# Altium project 475_PCB_Collar.PrjPcb
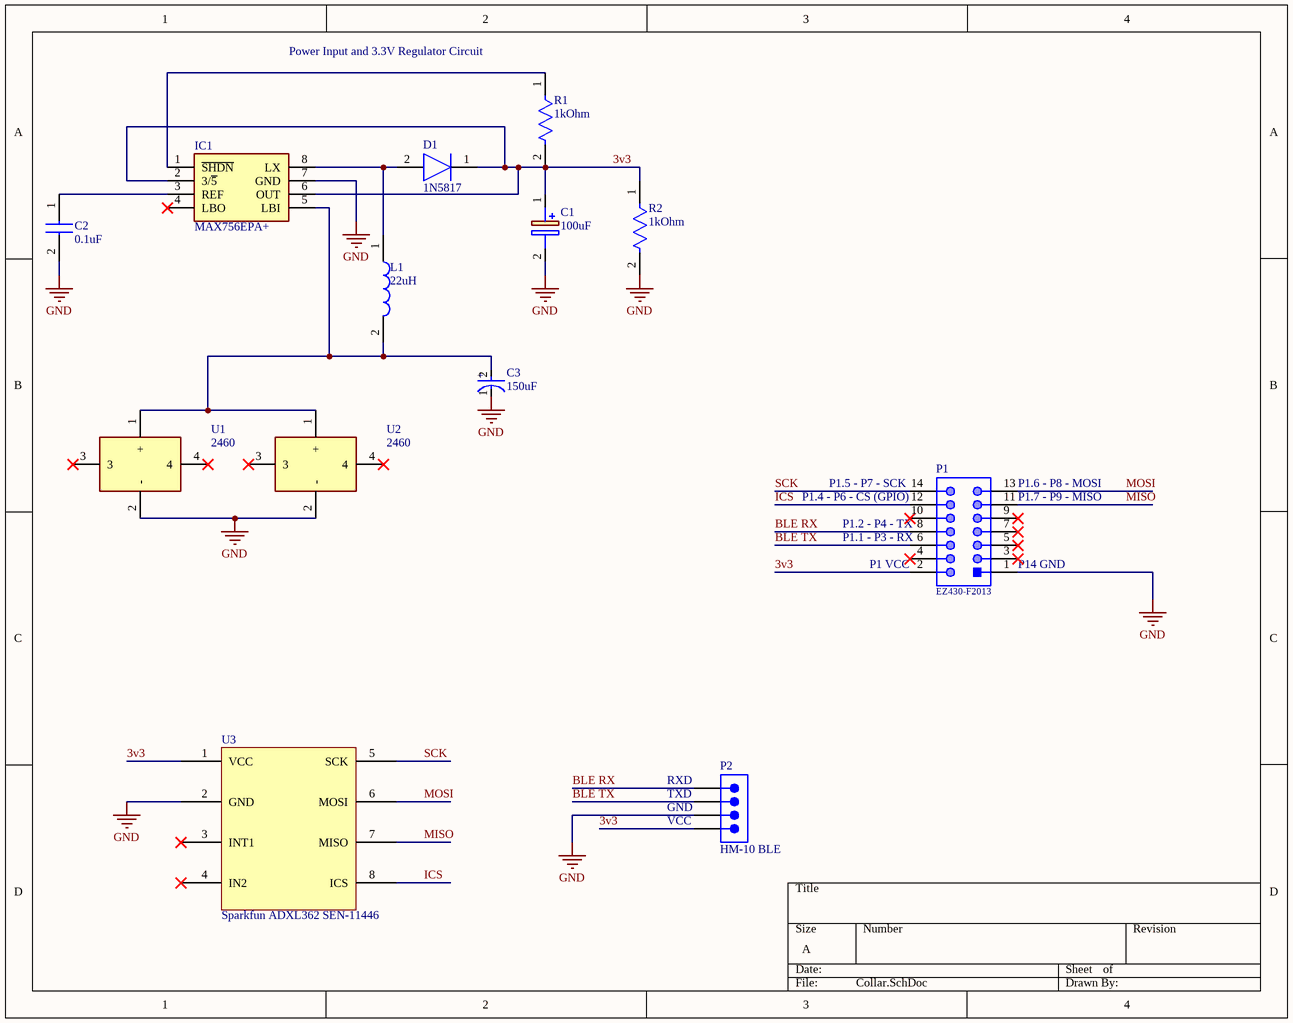
[diagram p0: Collar.SchDoc]
1 sheet, 13 parts. Net scope: global (net labels, ports and power ports of the same name join across sheets).
Board file: Collar.PcbDoc

## Sheet Collar.SchDoc
size A; SheetNumber: 1; SheetTotal: 1

### Parts
C1  100uF  [CAPPRD200W50D550H1250]
C2  0.1uF  [K104K10X7RF5UH5]
C3  150uF  [FP-UCY2V151MHD-MFG]
D1  1N5817  [DIOAD1405W86L465D235]
IC1  MAX756EPA+  [DIP794W56P254L938H457Q8N]
L1  22uH  [INDAD2550W80L950D400]
P1  EZ430-F2013  [61301421121]
P2  HM-10 BLE  [SMTC-TSW-104-08-X-S]
R1  1kOhm  [FP-MRS25-MFG]
R2  1kOhm  [FP-MRS25-MFG]
U1  2460  [2460]
U2  2460  [2460]
U3  Sparkfun ADXL362 SEN-11446  [ADXL362 Breakout Board]

### Nets
GND: C1.2(-) C2.2 C3.1(C) IC1.7(GND) P1.1(P14) P2.2(GND) R2.2 U1.2(-) U2.2(-) U3.2(GND)
3v3: C1.1(+) D1.1(K) IC1.2(3/~{5}) IC1.6(OUT) P1.2(P1) P2.1(VCC) R1.2 R2.1 U3.1(VCC)
BLE RX: P1.8(P4) P2.4(RXD)
BLE TX: P1.6(P3) P2.3(TXD)
ICS: P1.12(P6) U3.8(ICS)
MISO: P1.11(P9) U3.7(MISO)
MOSI: P1.13(P8) U3.6(MOSI)
SCK: P1.14(P7) U3.5(SCK)
NetC2_1: C2.1 IC1.3(REF)
NetC3_2: C3.2(A) IC1.5(LBI) L1.2 U1.1(+) U2.1(+)
NetD1_2: D1.2(A) IC1.8(LX) L1.1
NetIC1_1: IC1.1(~{SHDN}) R1.1

Not connected (* = marked no-connect by the designer): IC1 4(LBO)*; P1 3(P13)* 4(P2)* 5(P12)* 7(P11)* 9(P10)* 10(P5)*; U1 3* 4*; U2 3* 4*; U3 3(INT1)* 4(IN2)*

### Notes on the sheet
- (near R1) Power Input and 3.3V Regulator Circuit
- (near P1) P1.4 - P6 - CS (GPIO)
- (near P1) P1.5 - P7 - SCK
- (near P1) P1.6 - P8 - MOSI
- (near P1) P1.7 - P9 - MISO
- (near P1) P1.2 - P4 - TX
- (near P1) P1.1 - P3 - RX
- (near P1) P1 VCC
- (near P1) P14 GND
- (near P2) RXD
- (near P2) TXD
- (near P2) GND
- (near P2) VCC
- (in symbol CMP-12462-000029-1) +

### Library data of the parts
C1 = 107CKE025MEM: Capacitor Polarised; Manufacturer_Name: Cinch Connectivity Solutions; Datasheet Link: https://componentsearchengine.com/Datasheets/2/107CKE025MEM.pdf; Height: 12.5mm; Manufacturer_Part_Number: 107CKE025MEM
C2 = K104K10X7RF5UH5: Capacitor; Manufacturer_Name: Vishay; Datasheet Link: https://www.vishay.com/docs/45171/kseries.pdf; Height: 6.2mm; Manufacturer_Part_Number: K104K10X7RF5UH5; Mouser Part Number: 594-K104K10X7RF5UH5; Mouser Price/Stock: https://www.mouser.co.uk/ProductDetail/Vishay-BC-Components/K104K10X7RF5UH5?qs=rLgk8CAOBHbAqIwDswVbzA%3D%3D; Arrow Part Number: K104K10X7RF5UH5; Arrow Price/Stock: https://www.arrow.com/en/products/k104k10x7rf5uh5/vishay
C3 = CMP-12462-000029-1: CAP ALUM 150UF 20% 350V RADIAL; Lead/Base Style: Straight; Ripple Current: 1.08A; Life (Hours): 12000Hour; Dissipation Factor: 0.24%; Height - Seated (Max): 1.457inch; Packaging: Bulk; Height: 35.5mm; Voltage Rating (DC): 350V; Min Operating Temperature: -40°C; Max Operating Temperature: 105°C; Case/Package: Radial; Series: CY; Length: 35.5mm; Lead Pitch: 0.295inch; Package Quantity: 50; Tolerance: 20%; Diameter: 18mm; Capacitance: 150uF; Voltage Rating: 350V; RoHS Compliant: Yes; Mount: Through Hole; Features: General Purpose; Termination: Radial
D1 = 1N5817: Diode; Manufacturer_Name: ON Semiconductor; Datasheet Link: http://www.onsemi.com/pub/Collateral/1N5817-D.PDF; Manufacturer_Part_Number: 1N5817; Mouser Part Number: 512-1N5817; Mouser Price/Stock: https://www.mouser.co.uk/ProductDetail/ON-Semiconductor-Fairchild/1N5817?qs=Ro3gc6G1sTm8wr1Du93jFw%3D%3D; Arrow Part Number: 1N5817; Arrow Price/Stock: https://www.arrow.com/en/products/1n5817/on-semiconductor
IC1 = MAX756EPA+: Integrated Circuit; Manufacturer_Name: Maxim Integrated; Datasheet Link: https://datasheets.maximintegrated.com/en/ds/MAX756-MAX757.pdf; Height: 4.572mm; Manufacturer_Part_Number: MAX756EPA+; Mouser Part Number: 700-MAX756EPA; Mouser Price/Stock: https://www.mouser.co.uk/ProductDetail/Maxim-Integrated/MAX756EPA%2b?qs=Mqkh4jHMT8wojtrRK8SBig%3D%3D
L1 = B78108E1223K000: Inductor; Manufacturer_Name: TDK; Datasheet Link: https://product.tdk.com/system/files/dam/doc/product/inductor/inductor/lead/data_sheet/30/ds/b78108_148e.pdf; Manufacturer_Part_Number: B78108E1223K000; Mouser Part Number: 871-B78108E1223K000; Mouser Price/Stock: https://www.mouser.com/Search/Refine.aspx?Keyword=871-B78108E1223K000
P1 = CMP-1502-01093-1: THT Vertical Pin Header WR-PHD, Pitch 2.54 mm, Dual Row, 14 pins; Manufacturer: Wurth Elektronik; Rated Current: 3A; Withstanding Voltage: 500VAC; Gender: Male; Pin Number: 14; Pitch: 2.54mm; Working Voltage: 250VAC; Contact Resistance: 20mOhm; Mounting Technology: THT; Orientation: Vertical; Packaging: Bag; Part Number: 61301421121; Manufacturer URL: http://www.we-online.de; Datasheet URL: https://katalog.we-online.de/em/datasheet/6130xx21121.pdf; Operating Temperature: -40to105degC; Package Reference: 61301421121; Publisher: WurthElektronik; Row Number: Dual
P2 = CMP-1024-00357-1: 0.025" SQ Post Header, Through-hole, Vertical, -55 to 125 degC, 2.54 mm Pitch, 4-Pin, Male, RoHS; Manufacturer: Samtec; PartNumber: TSW-104-08-G-S; Pitch: 2.54 mm; RoHS: True; ComponentLink3URL: http://www.samtec.com/documents/webfiles/cpdf/TSW-XXX-XX-XXX-X-XX-XXX-MKT.pdf; Mounting Technology: Through-hole; ComponentLink2URL: http://www.samtec.com/documents/webfiles/pdf/TSW_TH.PDF; ComponentLink1URL: http://www.samtec.com; ComponentLink3Description: Package Specification; PackageVersion: DM, 8/1988; ComponentLink2Description: Datasheet; PackageReference: TSW-104-08-X-S; PackageDescription: .025[0.64] SQ. Post Terminal Strip Assembly; ComponentLink1Description: Manufacturer URL; Temperature Range: -55 to 125 degC; DatasheetVersion: F-214; Orientation: Vertical
R1 R2 = CMP-02408-000003-1: RES 1.1K OHM 0.6W 1% AXIAL; Manufacturer: Vishay BC Components; Manufacturer Part Number: MRS25000C1101FCT00; Voltage Rating: 350V; Resistance: 1.1kΩ; Temperature Coefficient: 50ppm/°C; Value: 1.1kΩ; Device Class L1: Passive Components; Height: 2.5mm; Octopart: https://octopart.com/mrs25000c1101fct00-vishay-43740214; Temperature Range Low: -55°C; Temperature: -55°C to +155°C; Temperature Range High: +155°C; Lead Free: Yes; Mouser Description: Thin Film Resistors .6watt 1.1Kohms 1%; Power Rating: 0.6W; Digikey Description: RES 1.1K OHM 0.6W 1% AXIAL; RoHS: TRUE; Tolerance: 1%; Package: MRS25; Device Class L3: Through-Hole Resistors; ComponentLink2URL: http://www.vishay.com/docs/28724/mrs16m25.pdf; ComponentLink2Description: Datasheet; Composition: Thin Film; Automotive: No; Ipc Land Pattern Name: RESAD1000W75L650D250; Device Class L2: Resistors; Category: Res; Series: MRS25
U1 U2 = 2460: Undefined or Miscellaneous; Manufacturer_Name: Keystone Electronics; Datasheet Link: http://www.keyelco.com/product-pdf.cfm?p=1025; Height: 14mm; Manufacturer_Part_Number: 2460; Mouser Part Number: 534-2460; Mouser Price/Stock: https://www.mouser.co.uk/ProductDetail/Keystone-Electronics/2460?qs=3CbvriavsLB6FI3qURcWXQ%3D%3D
U3 = ADXL362 Breakout Board